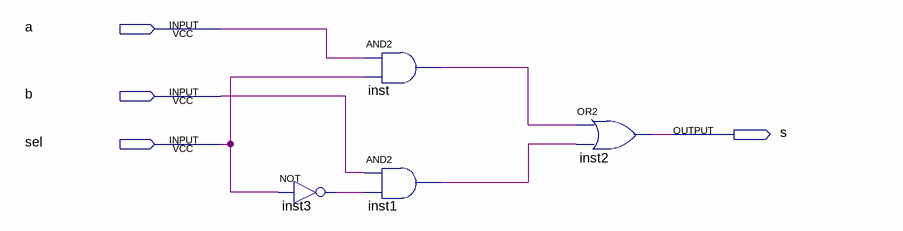
[diagram p0: schematic sheet]
// Quartus schematic mux_2_1.bdf as structural Verilog: 4 symbols, 4 pins
module mux_2_1 (
  input  a,
  input  b,
  input  sel,
  output s
);

  wire inst1_out, inst3_out, inst_out;

  not inst3 (inst3_out, sel);
  and inst (inst_out, a, sel);
  and inst1 (inst1_out, b, inst3_out);
  or inst2 (s, inst_out, inst1_out);
endmodule
